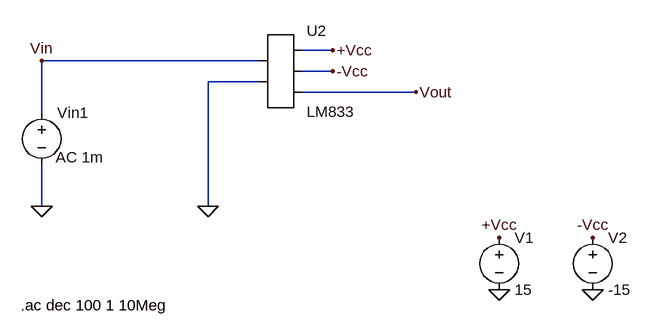
[diagram p0: schematic opamp LM833 open loop.asc]
* opamp LM833 open loop.asc
* U2: LM833 (symbol AutoGenerated\LM833 not available, pins judged from their places): pin1=Vin pin2=0 pin3=+Vcc pin4=-Vcc pin5=Vout
Vin1 Vin 0 AC 1m
V1 +Vcc 0 15
V2 -Vcc 0 -15
.ac dec 100 1 10Meg
.backanno
.end

* Results of the author's LTspice run, read from the files saved beside the schematic
* Operating Point, zero values left out:
*   V(-vcc) = -15 V
*   V(+vcc) = 15 V
*   V(vout) = 39.95 mV
*   I(V2) = 2.136 mA
*   I(V1) = -2.136 mA
*   I(Vin1) = 250 nA
*   Ix(u2:2) = -250 nA
*   Ix(u2:1) = -250 nA
*   Ix(u2:4) = 2.136 mA
*   Ix(u2:5) = -2.136 mA
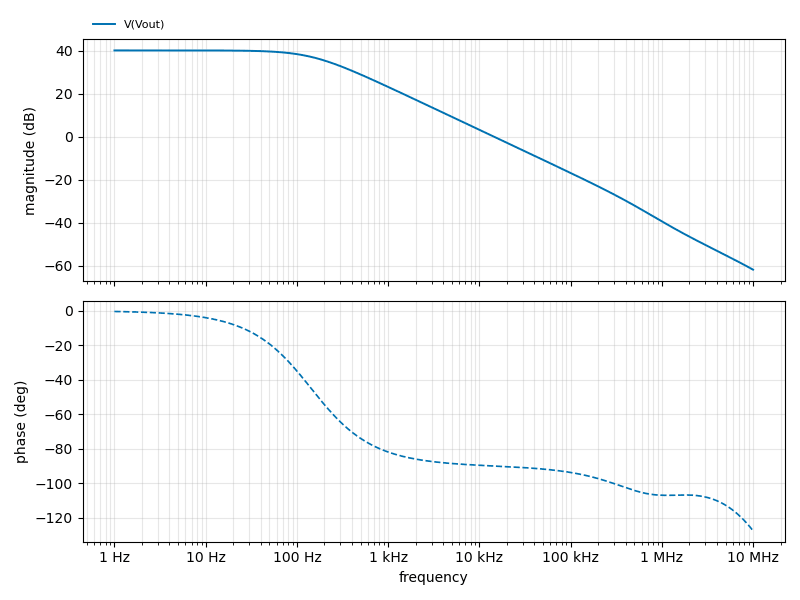
[diagram p1: AC Analysis of opamp LM833 open loop.asc, plotted from the saved traces]
* AC Analysis, 1 run:
*   V(Vout): 40.10 dB at 1 Hz, -61.78 dB at 10 MHz, peak 40.10 dB at 1 Hz, 3 dB below the peak at 143.3 Hz